# EAGLE design untitled (EAGLE 9.5.1)

## Sheet 1 of 2
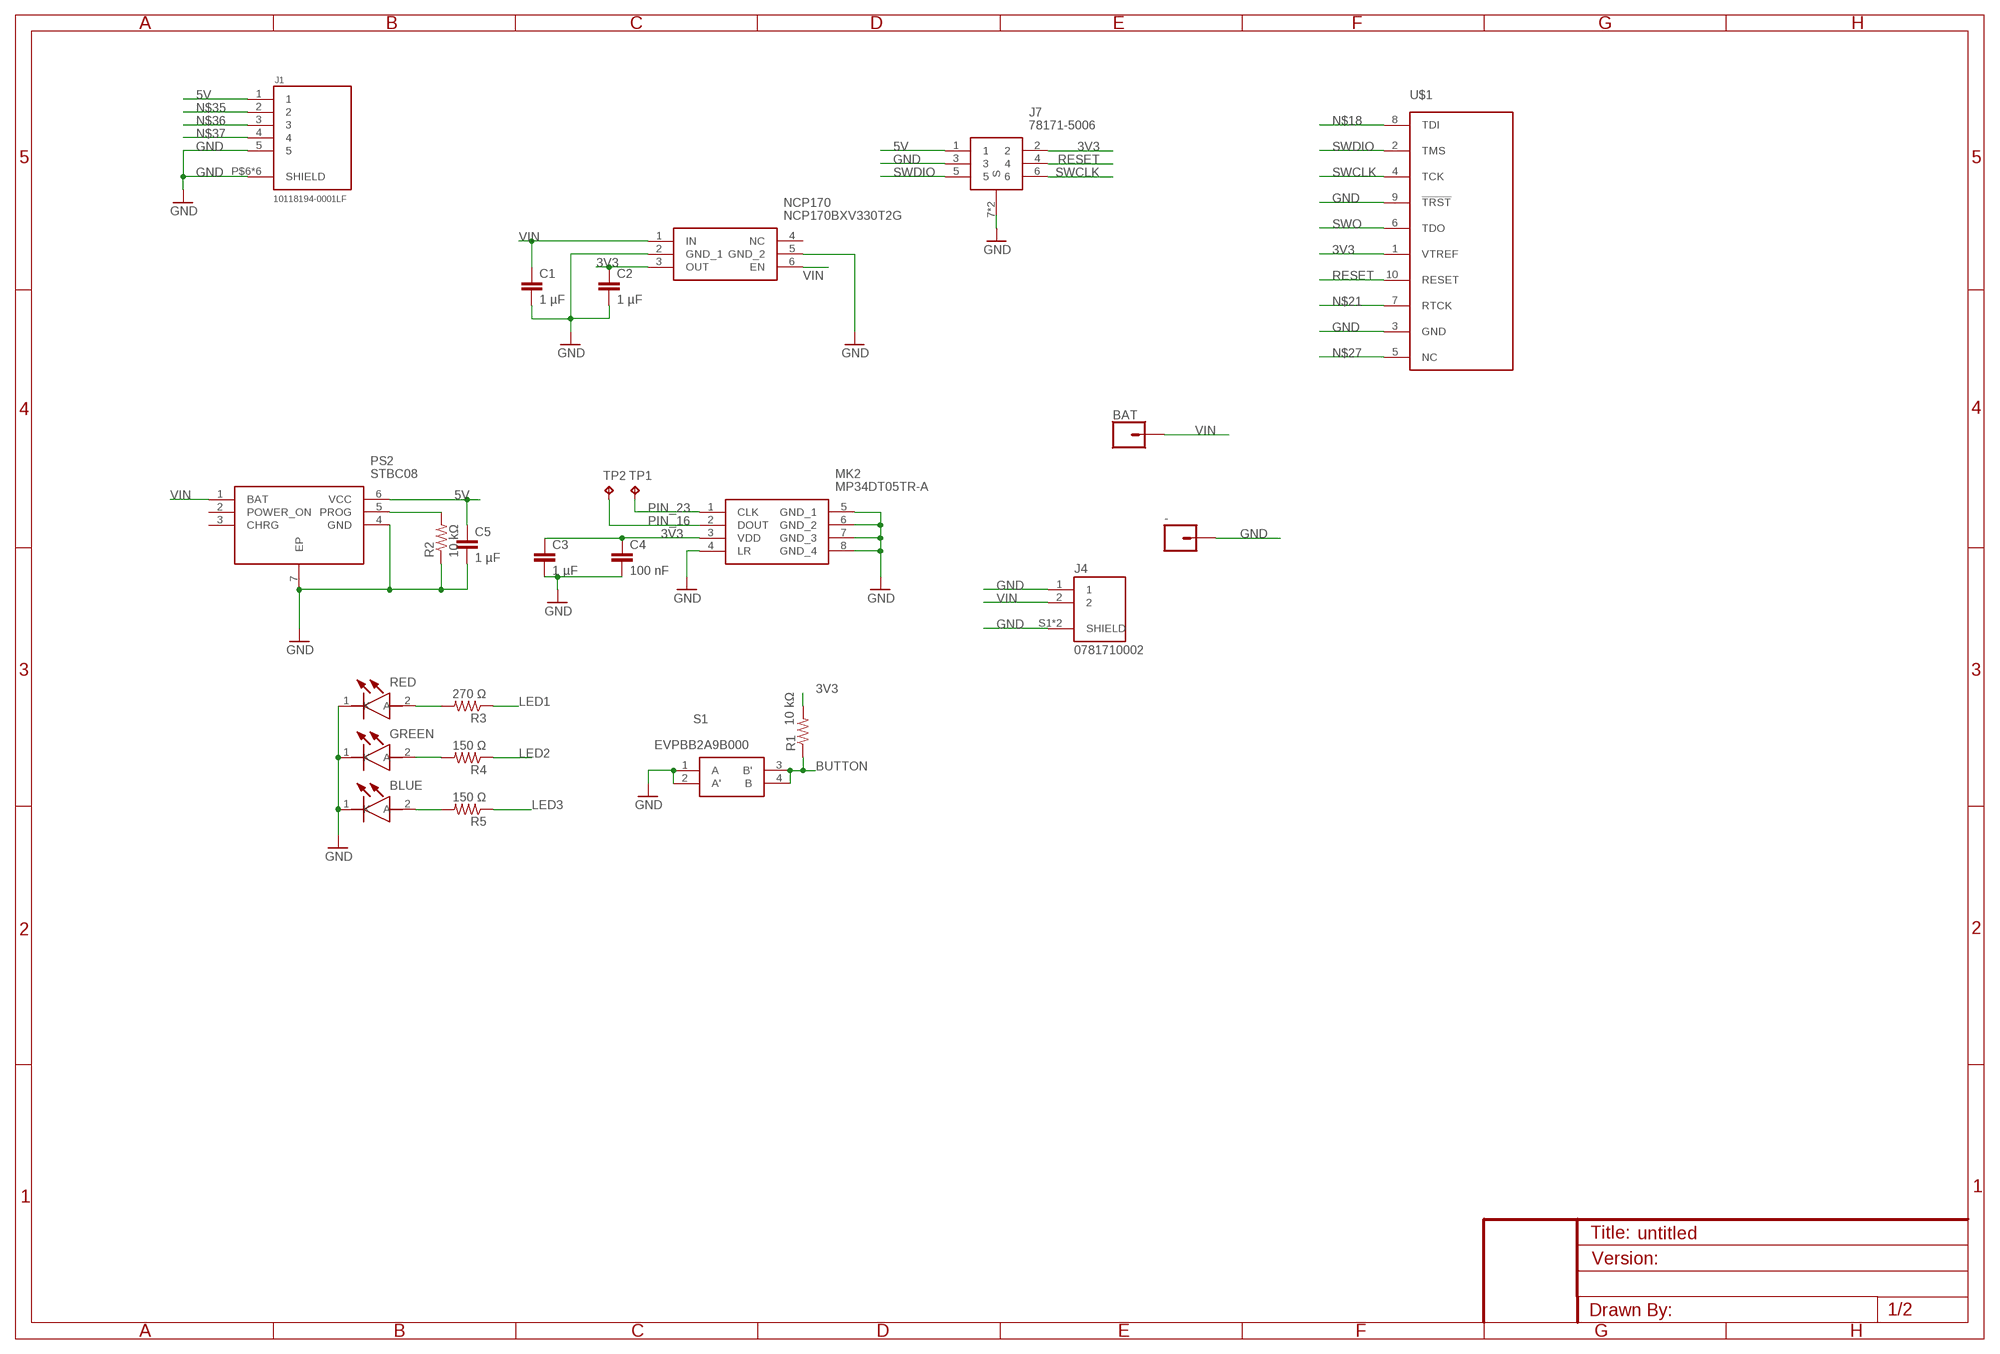
[diagram p0: schematic, sheet 1]

### Parts
-  CONN_01  [1X01]
BAT  CONN_01  [1X01]
BLUE  150040GS73220  [LEDC1005X50N]
C1  1 µF  SPARKFUN_CAP0402-CAP  [SPARKFUN_0402-CAP]
C2  1 µF  SPARKFUN_CAP0402-CAP  [SPARKFUN_0402-CAP]
C3  1 µF  SPARKFUN_CAP0402-CAP  [SPARKFUN_0402-CAP]
C4  100 nF  SPARKFUN_CAP0402-CAP  [SPARKFUN_0402-CAP]
C5  1 µF  SPARKFUN_CAP0402-CAP  [SPARKFUN_0402-CAP]
GREEN  150040GS73220  [LEDC1005X50N]
J1  10118194-0001LF  [AMPHENOL_10118194-0001LF]
J4  0781710002  [MOLEX_0781710002]
J7  78171-5006  [78171-5006]
MK2  MP34DT05TR-A  [MP34DT05TRA]
NCP170  NCP170BXV330T2G  [SOTFL50P160X60-6N]
PS2  STBC08  STBC08PMR  [SON95P300X300X100-7N]
R1  10 kΩ  SPARKFUN_RESISTOR0402-RES  [SPARKFUN_0402-RES]
R2  10 kΩ  SPARKFUN_RESISTOR0402-RES  [SPARKFUN_0402-RES]
R3  270 Ω  SPARKFUN_RESISTOR0402-RES  [SPARKFUN_0402-RES]
R4  150 Ω  SPARKFUN_RESISTOR0402-RES  [SPARKFUN_0402-RES]
R5  150 Ω  SPARKFUN_RESISTOR0402-RES  [SPARKFUN_0402-RES]
RED  150040GS73220  [LEDC1005X50N]
S1  EVPBB2A9B000  [EVPBB2A9B000]
TP1  TPTP06R  [TP06R]
TP2  TPTP06R  [TP06R]
U$1  TC2050-NL-MCP-NL  [TC2030-MCP-NL]

### Nets
3V3: C2.1 C3.1 C4.1 J7.2 MK2.3(VDD) NCP170.3(OUT) R1.2 U$1.1(VTREF) ; also sheet 2
5V: C5.1 J1.1 J7.1 PS2.6(VCC)
BUTTON: R1.1 S1.3(B') S1.4(B) ; also sheet 2
GND: -.1 BLUE.1(K) C1.2 C2.2 C3.2 C4.2 C5.2 GREEN.1(K) J1.5 J1.P$6(SHIELD) J1.P$7(SHIELD) J1.P$8(SHIELD) J1.P$9(SHIELD) J1.P$10(SHIELD) J1.P$11(SHIELD) J4.1 J4.S1(SHIELD) J4.S2(SHIELD) J7.3 J7.7(S) J7.8(S) MK2.4(LR) MK2.5(GND_1) MK2.6(GND_2) MK2.7(GND_3) MK2.8(GND_4) NCP170.2(GND_1) NCP170.5(GND_2) PS2.4(GND) PS2.7(EP) R2.1 RED.1(K) S1.1(A) S1.2(A') U$1.3(GND) U$1.9(!TRST) ; also sheet 2
LED1: R3.1 ; also sheet 2
LED2: R4.1 ; also sheet 2
LED3: R5.1 ; also sheet 2
N$2: R3.2 RED.2(A)
N$3: GREEN.2(A) R4.2
N$4: BLUE.2(A) R5.2
N$18: U$1.8(TDI)
N$21: U$1.7(RTCK)
N$23: PS2.5(PROG) R2.2
N$27: U$1.5(NC)
N$35: J1.2
N$36: J1.3
N$37: J1.4
PIN_16: MK2.2(DOUT) TP2.TP ; also sheet 2
PIN_23: MK2.1(CLK) TP1.TP ; also sheet 2
RESET: J7.4 U$1.10(RESET) ; also sheet 2
SWCLK: J7.6 U$1.4(TCK) ; also sheet 2
SWDIO: J7.5 U$1.2(TMS) ; also sheet 2
SWO: U$1.6(TDO) ; also sheet 2
VIN: BAT.1 C1.1 J4.2 NCP170.1(IN) NCP170.6(EN) PS2.1(BAT)
Unconnected: NCP170.4(NC) PS2.2(POWER_ON) PS2.3(CHRG)

## Sheet 2 of 2
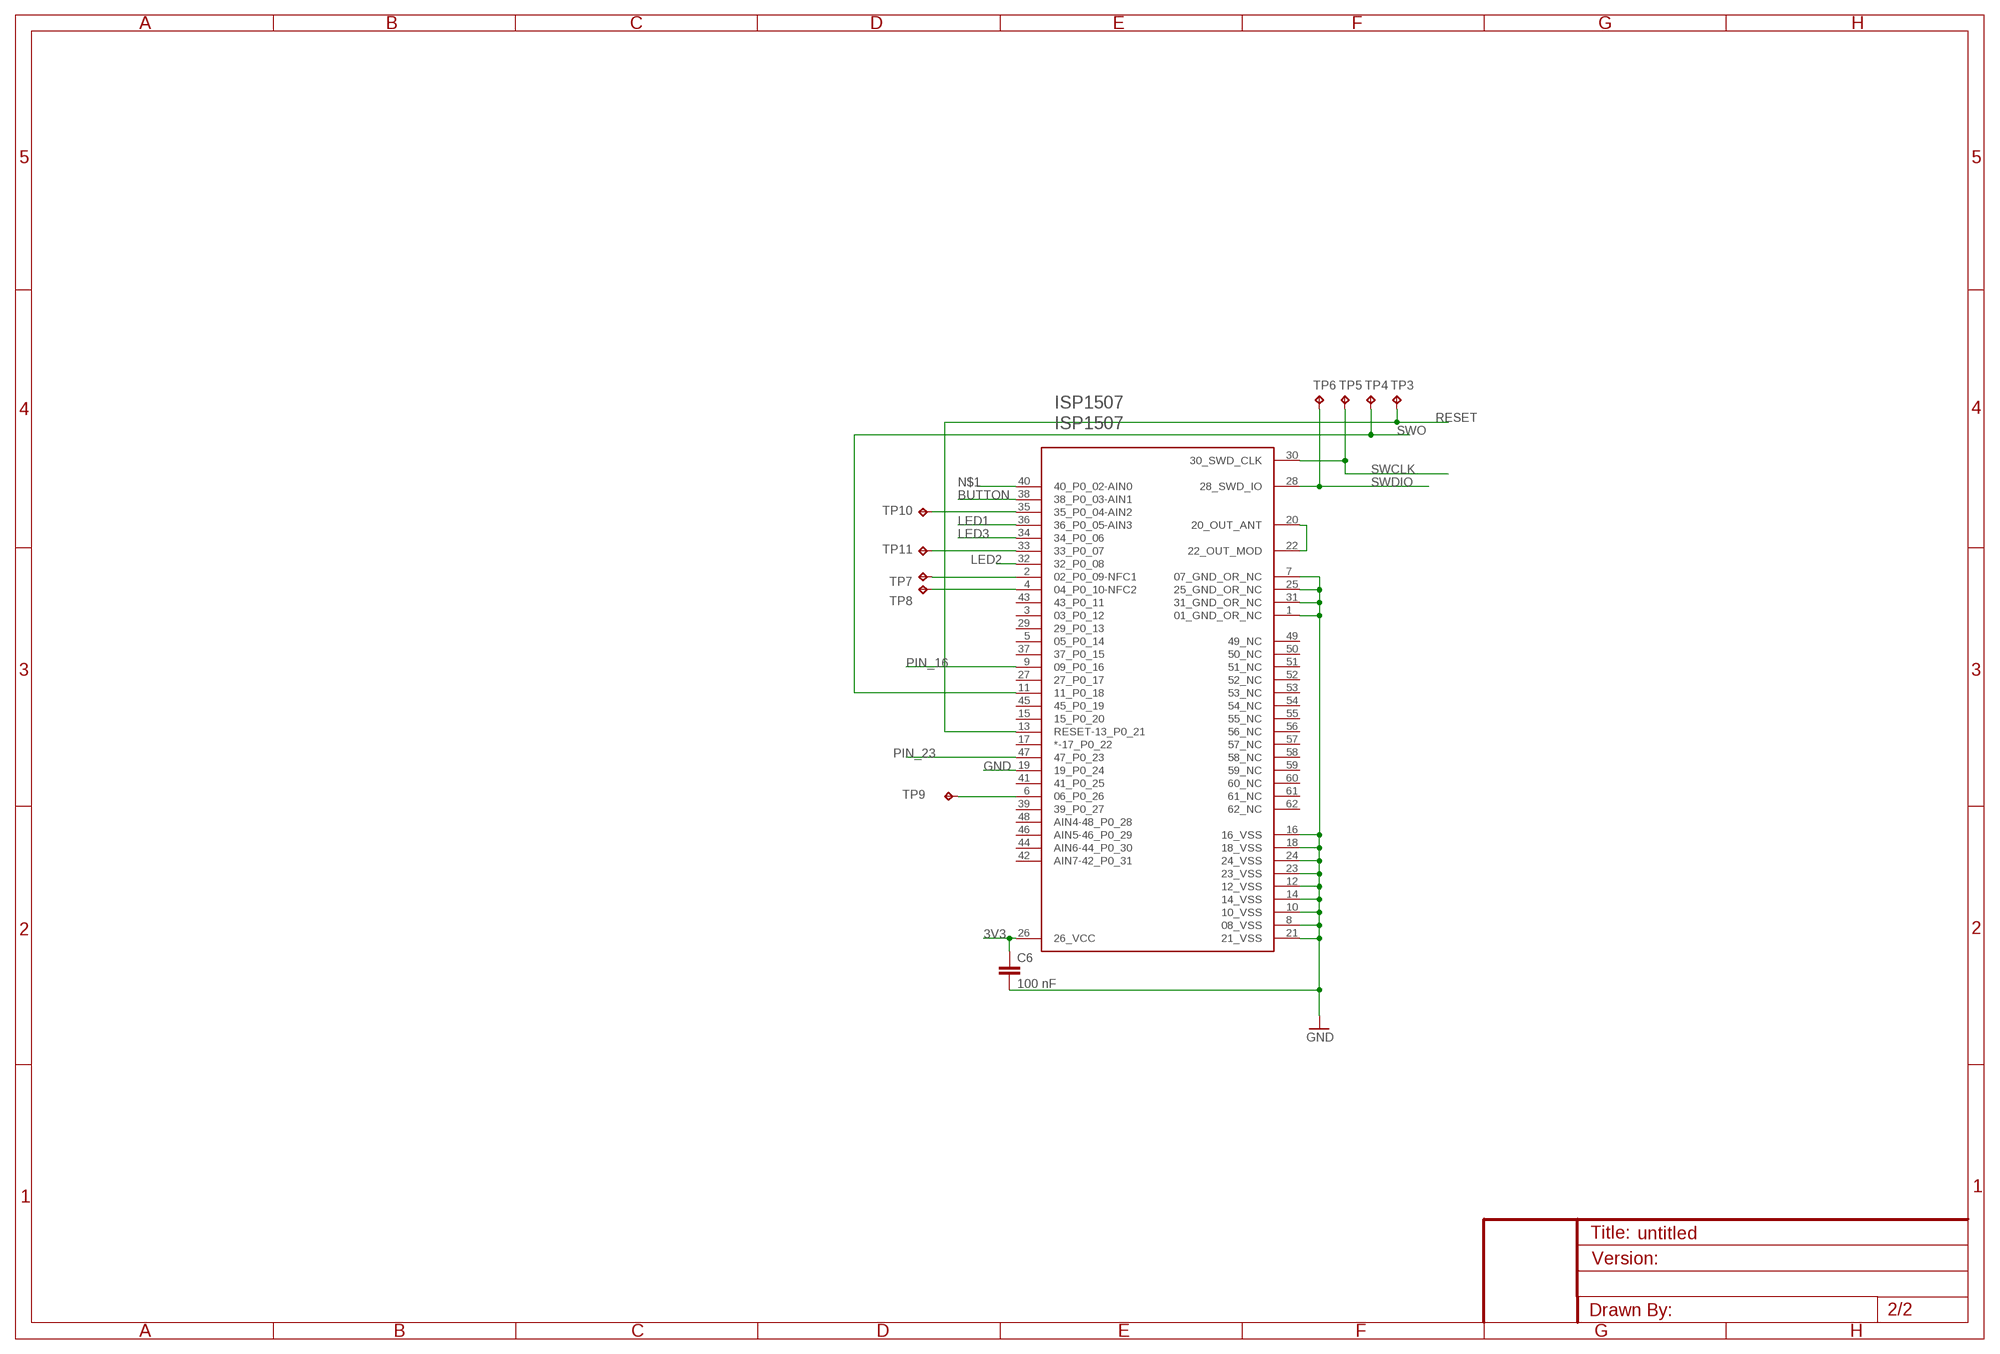
[diagram p1: schematic, sheet 2]

### Parts
C6  100 nF  SPARKFUN_CAP0402-CAP  [SPARKFUN_0402-CAP]
ISP1507  ISP1507  [ISP1507]
TP3  TPTP06R  [TP06R]
TP4  TPTP06R  [TP06R]
TP5  TPTP06R  [TP06R]
TP6  TPTP06R  [TP06R]
TP7  TPTP06R  [TP06R]
TP8  TPTP06R  [TP06R]
TP9  TPTP06R  [TP06R]
TP10  TPTP06R  [TP06R]
TP11  TPTP06R  [TP06R]

### Nets
3V3: C6.1 ISP1507.26(26_VCC) ; also sheet 1
BUTTON: ISP1507.38(38_P0_03-AIN1) ; also sheet 1
GND: C6.2 ISP1507.1(01_GND_OR_NC) ISP1507.7(07_GND_OR_NC) ISP1507.8(08_VSS) ISP1507.10(10_VSS) ISP1507.12(12_VSS) ISP1507.14(14_VSS) ISP1507.16(16_VSS) ISP1507.18(18_VSS) ISP1507.19(19_P0_24) ISP1507.21(21_VSS) ISP1507.23(23_VSS) ISP1507.24(24_VSS) ISP1507.25(25_GND_OR_NC) ISP1507.31(31_GND_OR_NC) ; also sheet 1
LED1: ISP1507.36(36_P0_05-AIN3) ; also sheet 1
LED2: ISP1507.32(32_P0_08) ; also sheet 1
LED3: ISP1507.34(34_P0_06) ; also sheet 1
N$1: ISP1507.40(40_P0_02-AIN0)
N$5: ISP1507.6(06_P0_26) TP9.TP
N$6: ISP1507.2(02_P0_09-NFC1) TP7.TP
N$7: ISP1507.4(04_P0_10-NFC2) TP8.TP
N$13: ISP1507.35(35_P0_04-AIN2) TP10.TP
N$14: ISP1507.33(33_P0_07) TP11.TP
N$24: ISP1507.20(20_OUT_ANT) ISP1507.22(22_OUT_MOD)
PIN_16: ISP1507.9(09_P0_16) ; also sheet 1
PIN_23: ISP1507.47(47_P0_23) ; also sheet 1
RESET: ISP1507.13(RESET-13_P0_21) TP3.TP ; also sheet 1
SWCLK: ISP1507.30(30_SWD_CLK) TP5.TP ; also sheet 1
SWDIO: ISP1507.28(28_SWD_IO) TP6.TP ; also sheet 1
SWO: ISP1507.11(11_P0_18) TP4.TP ; also sheet 1
Unconnected: ISP1507.3(03_P0_12) ISP1507.5(05_P0_14) ISP1507.15(15_P0_20) ISP1507.17(*-17_P0_22) ISP1507.27(27_P0_17) ISP1507.29(29_P0_13) ISP1507.37(37_P0_15) ISP1507.39(39_P0_27) ISP1507.41(41_P0_25) ISP1507.42(AIN7-42_P0_31) ISP1507.43(43_P0_11) ISP1507.44(AIN6-44_P0_30) ISP1507.45(45_P0_19) ISP1507.46(AIN5-46_P0_29) ISP1507.48(AIN4-48_P0_28) ISP1507.49(49_NC) ISP1507.50(50_NC) ISP1507.51(51_NC) ISP1507.52(52_NC) ISP1507.53(53_NC) ISP1507.54(54_NC) ISP1507.55(55_NC) ISP1507.56(56_NC) ISP1507.57(57_NC) ISP1507.58(58_NC) ISP1507.59(59_NC) ISP1507.60(60_NC) ISP1507.61(61_NC) ISP1507.62(62_NC)

## Library data of the parts
- BAT = SparkFun-Connectors:CONN_01: Single connection point. Often used as Generic Header-pin footprint for 0.1 inch spaced/style header connections On any of the 0.1 inch spaced packages, you can populate with these: Break Away Headers - Straight <https://www.sparkfun.com/products/116> (PRT-00116) Break Away Male Headers - Right Angle <https://www.sparkfun.com/products/553> (PRT-00553) Female Headers <https://www.sparkfun.com/products/115> (PRT-00115) Break Away Headers - Machine Pin <https://www.sparkfun.com/products/117> (PRT-00117) Break Away Female Headers - Swiss Machine Pin <https://www.sparkfun.com/products/743> (PRT-00743) This device is also useful as a general connection point to wire up your design to another part of your project. Our various solder wires solder well into these plated through hole pads. Hook-Up Wire - Assortment (Stranded, 22 AWG) <https://www.sparkfun.com/products/11375> (PRT-11375) Hook-Up Wire - Assortment (Solid Core, 22 AWG) <https://www.sparkfun.com/products/11367> (PRT-11367) View the entire wire category on our website here <https://www.sparkfun.com/categories/141> Special notes: SMTSO-256-ET is a "flush mount" nut for a 4-40 screw. We mostly use this on specialty testbeds; it is a nice way to connect hardware to your PCB at an adjustable hieght. Also note, the SNAP packages are for using a snappable style connector. We sell a baggie of snaps and they are also used on two LilyPad designs: Snap Assortment - 30 pack (male and female) <https://www.sparkfun.com/products/11347> (DEV-11347) LilyPad Arduino SimpleSnap <https://www.sparkfun.com/products/10941> (DEV-10941) LilyPad SimpleSnap Protoboard <https://www.sparkfun.com/products/10940> (DEV-10940)
BLUE GREEN RED = 150040GS73220:150040GS73220: WURTH ELEKTRONIK - 150040GS73220 - LED, Green, SMD, 0402, Rectangular, 3.3V/20mA Forward, 525nm, 750mcd, 120? Viewing Angle Source: Datasheet <https://www.farnell.com/cad/2723069.pdf>; DESCRIPTION: WURTH ELEKTRONIK - 150040GS73220 - LED, Green, SMD, 0402, Rectangular, 3.3V/20mA Forward, 525nm, 750mcd, 120? Viewing Angle; HEIGHT: 0.5mm; MANUFACTURER_NAME: Wurth Elektronik; MANUFACTURER_PART_NUMBER: 150040GS73220
C1-C6 = OCTA-EZR_v1:SPARKFUN_CAP: Capacitor Standard 0603 ceramic capacitor, and 0.1" leaded capacitor.
ISP1507 = ISP1507:ISP1507: ISP1507 BLE Module Based on the nRF52832 Bluetooth Low Energy Chip with Integrated Antenna, oscillators and Power Supply http://www.insightsip.com/products/bluetooth-smart-modules/isp1507
J1 = 10118194-0001LF:10118194-0001LF: Micro Usb, 2.0 Type b, Rcpt, Smt
J4 = 0781710002:0781710002: Conn Wire to Board HDR 2 POS 1.2mm Solder ST SMD; AVAILABILITY: Unavailable; DESCRIPTION: Conn Wire to Board HDR 2 POS 1.2mm Solder ST SMD Pico-EZmateâ¢ Embossed T/R; MF: Molex; MP: 0781710002; PACKAGE: None; PRICE: None
J7 = 78171-5006:78171-5006: Molex 78171 Series, 1.2mm Pitch 6 Way 1 Row Vertical PCB Header, Solder Termination, 1.5A Source: Datasheet <http://www.molex.com/molex/products/datasheet.jsp?part=active/0781715006_PCB_HEADERS.xml&channel=Products&Lang=en-US>; DESCRIPTION: Molex 78171 Series, 1.2mm Pitch 6 Way 1 Row Vertical PCB Header, Solder Termination, 1.5A; HEIGHT: mm; MANUFACTURER_NAME: Molex; MANUFACTURER_PART_NUMBER: 78171-5006; MOUSER_PART_NUMBER: 538-78171-5006; MOUSER_PRICE-STOCK: https://www.mouser.com/Search/Refine.aspx?Keyword=538-78171-5006; RS_PART_NUMBER: 8967484; RS_PRICE-STOCK: http://uk.rs-online.com/web/p/products/8967484
MK2 = MP34DT05TR-A:MP34DT05TR-A: STMICROELECTRONICS - MP34DT05TR-A - MEMS MICROPHONE, 3.6V, HCLGA-4 Source: Datasheet <http://www.st.com/content/ccc/resource/technical/document/datasheet/group3/c7/90/d3/f6/b7/e7/40/c8/DM00415595/files/DM00415595.pdf/jcr:content/translations/en.DM00415595.pdf>; DESCRIPTION: STMICROELECTRONICS - MP34DT05TR-A - MEMS MICROPHONE, 3.6V, HCLGA-4; HEIGHT: 1mm; MANUFACTURER_NAME: STMicroelectronics; MANUFACTURER_PART_NUMBER: MP34DT05TR-A; MOUSER_PART_NUMBER: 511-MP34DT05TR-A; MOUSER_PRICE-STOCK: https://www.mouser.com/Search/Refine.aspx?Keyword=511-MP34DT05TR-A
NCP170 = NCP170BXV330T2G:NCP170BXV330T2G: LDO Voltage Regulators ULTRA-LOW IQ 150 MA Source: Datasheet <http://www.onsemi.com/pub/Collateral/NCP170-D.PDF>; DESCRIPTION: LDO Voltage Regulators ULTRA-LOW IQ 150 MA; HEIGHT: 0.6mm; MANUFACTURER_NAME: ON Semiconductor; MANUFACTURER_PART_NUMBER: NCP170BXV330T2G; MOUSER_PART_NUMBER: 863-NCP170BXV330T2G; MOUSER_PRICE-STOCK: https://www.mouser.com/Search/Refine.aspx?Keyword=863-NCP170BXV330T2G
PS2 = STBC08PMR:STBC08PMR: STMicroelectronics STBC08PMR, Battery Charger, 800mA, 6-Pin DFN Source: Datasheet <https://componentsearchengine.com/Datasheets/2/STBC08PMR.pdf>; ARROW_PART_NUMBER: STBC08PMR; DESCRIPTION: STMicroelectronics STBC08PMR, Battery Charger, 800mA, 6-Pin DFN; HEIGHT: 1mm; MANUFACTURER_NAME: STMicroelectronics; MANUFACTURER_PART_NUMBER: STBC08PMR; RS_PART_NUMBER: 1655533
R1-R5 = OCTA-EZR_v1:SPARKFUN_RESISTOR: Resistor Basic schematic elements and footprints for 0603, 1206, and PTH resistors.
S1 = EVPBB2A9B000:EVPBB2A9B000: IP67 Push Plate Tact Switch, SPST 20 mA @ 15 V dc 0.7 (Dia.)mm Surface Mount Source: Datasheet <https://industrial.panasonic.com/ac/cdn/e/control/switch/light-touch/catalog/sw_lt_eng_2616s.pdf>; DESCRIPTION: IP67 Push Plate Tact Switch, SPST 20 mA @ 15 V dc 0.7 (Dia.)mm Surface Mount; HEIGHT: 0mm; MANUFACTURER_NAME: Panasonic; MANUFACTURER_PART_NUMBER: EVPBB2A9B000; RS_PART_NUMBER: 1250187P; RS_PRICE-STOCK: http://uk.rs-online.com/web/p/products/1250187P
TP1-TP11 = testpad:TP: Test pad
U$1 = TC2050:TC2050-NL: TAG-CONNECT ISP Connector Manufacturer: Tag-Connect <www.tag-connect.com> Cable for easy In-Circuit PCB Programming. Designed for JTAG 10 pin, suitable for many others. Pin Connection for TC2050 NL. PAD Description 1 VTREF 2 TMS 3 GND 4 TCK 5 NC 6 TDO 7 RTCK 8 TDI 9 !TRST 10 RESET ©2009 ROFA.cz Modified 7/2011 by Tim McCarthy-Smith VIDA Products INC

## Net classes
0 default: width 0.178 mm

## Board
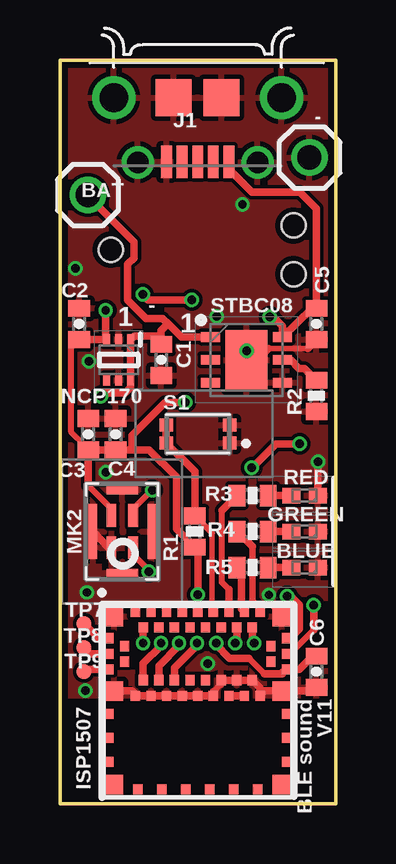
[diagram p2: board, top side]
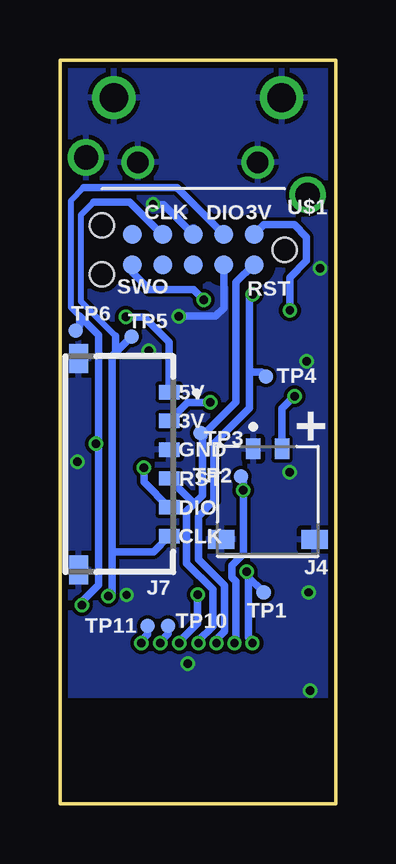
[diagram p3: board, bottom side, seen from below]

Size 11.5 x 31 mm. Coordinates in mm from the lower left corner, seen from the top.
Outline: 0,0 11.5,0 11.5,31 0,31 0,0
Copper layers (1*16): Top 0.018mm / dielectric 1.55mm / Bottom 0.018mm
Design rules "eC_2Layer_PClass6_BaseCopperO18_eCDefault *": minimum track width 0.1mm, minimum drill 0.35mm, track to track 0.15mm, track to pad 0.15mm, pad to pad 0.15mm, via to via 0.15mm, smd to smd 0mil, copper to edge 0.25mm, drill to drill 0.35mm, minimum pad ring 0.175mm, minimum via ring 0.125mm, stop-mask expansion 0mil, vias tented up to drill 0.45mm, thermal gap 0.2mm

### Footprints (pad centres in the part's own frame; a part is rotated, then mirrored left to right if it is on the bottom)
1X01 = drill 1.016 pad 1.524: 1 0,0
LEDC1005X50N = smd 0.75 x 0.65: 1 -0.55,0; 2 0.55,0
SPARKFUN_0402-CAP = smd 0.7 x 0.9: 1 -0.65,0; 2 0.65,0
ISP1507 = smd 0.8 x 0.8: 1 0.5,7.5; 7 0.5,4.4; 25 7.5,4.4; 31 7.5,7.5; 52 0.5,0.5; 59 7.5,0.5 | smd 0.4 x 0.4: 2 0.3,6.6; 3 0.95,6.275; 4 0.3,5.95; 5 0.95,5.625; 6 0.3,5.3; 8 1.4,4.2; 9 1.725,4.85; 10 2.05,4.2; 11 2.375,4.85; 12 2.7,4.2; 13 3.025,4.85; 14 3.35,4.2; 15 3.675,4.85; 16 4,4.2; 17 4.325,4.85; 18 4.65,4.2; 19 4.975,4.85; 20 5.3,4.2; 21 5.625,4.85; 22 5.95,4.2; 23 6.275,4.85; 24 6.6,4.2; 26 7.7,5.3; 27 7.05,5.625; 28 7.7,5.95; 29 7.05,6.275; 30 7.7,6.6; 32 6.6,7.7; 33 6.275,7.05; 34 5.95,7.7; 35 5.625,7.05; 36 5.3,7.7; 37 4.975,7.05; 38 4.65,7.7; 39 4.325,7.05; 40 4,7.7; 41 3.675,7.05; 42 3.35,7.7; 43 3.025,7.05; 44 2.7,7.7; 45 2.375,7.05; 46 2.05,7.7; 47 1.725,7.05; 48 1.4,7.7; 49 0.3,3.45; 50 0.3,2.45; 51 0.3,1.45; 53 1.5,0.3; 54 2.5,0.3; 55 3.5,0.3; 56 4.5,0.3; 57 5.5,0.3; 58 6.5,0.3; 60 7.7,1.45; 61 7.7,2.45; 62 7.7,3.45
AMPHENOL_10118194-0001LF = smd 0.45 x 1.35: 1 -3.84,2.675; 2 -3.19,2.675; 3 -2.54,2.675; 4 -1.89,2.675; 5 -1.24,2.675 | drill 0.9: P$6 -5.04,2.7; P$7 -0.04,2.7 | drill 1.2: P$8 -6.04,0; P$9 0.96,0 | smd 1.5 x 1.55: P$10 -3.54,0; P$11 -1.54,0
MOLEX_0781710002 = smd 0.6 x 0.85: 1 -0.6,3.775; 2 0.6,3.775 | smd 1.106 x 0.8: S1 -1.928,0; S2 1.953,0
78171-5006 = smd 0.6 x 0.85: 1 -3,4.34; 2 -1.8,4.34; 3 -0.6,4.34; 4 0.6,4.34; 5 1.8,4.34; 6 3,4.34 | smd 1.208 x 0.8: 7 -4.404,0.565; 8 4.404,0.565
MP34DT05TRA = smd 0.4 x 0.95: 1 -0.45,0.675; 2 -0.45,-0.675; 3 0.45,-0.675; 4 0.45,0.675 | smd 0.35 x 2.3: 5 -1.225,0; 6 1.225,0 | smd 1.3 x 0.35: 7 0,1.725; 8 0,-1.725
SOTFL50P160X60-6N = smd 0.475 x 0.3: 1 -0.838,0.5; 2 -0.838,0; 3 -0.838,-0.5; 4 0.838,-0.5; 5 0.838,0; 6 0.838,0.5
SON95P300X300X100-7N = smd 0.8 x 0.4: 1 -1.5,0.95; 2 -1.5,0; 3 -1.5,-0.95; 4 1.5,-0.95; 5 1.5,0; 6 1.5,0.95 | smd 1.75 x 2.5: 7 0,0
SPARKFUN_0402-RES = smd 0.7 x 0.9: 1 -0.65,0; 2 0.65,0
EVPBB2A9B000 = smd 0.55 x 0.55: 1 -1.336,0.364; 2 -1.336,-0.386; 3 1.314,-0.386; 4 1.314,0.364
TP06R = smd 0.6 x 0.6: TP 0,0
TC2030-MCP-NL = smd 0.787 x 0.787: 1 1.27,-0.635; 2 2.54,-0.635; 3 3.81,-0.635; 4 5.08,-0.635; 5 6.35,-0.635; 6 6.35,0.635; 7 5.08,0.635; 8 3.81,0.635; 9 2.54,0.635; 10 1.27,0.635 | hole 1: 0,0; 7.62,-1.016; 7.62,1.016

### Placement (x,y rotation side)
-  10.41,26.93 0 top
BAT  1.17,25.37 0 top
BLUE  10.2,9.84 180 top
C1  4.23,18.5 270 top
C2  0.8,20 90 top
C3  1.18,15.4 90 top
C4  2.32,15.4 90 top
C5  10.7,20 270 top
C6  10.7,5.5 270 top
GREEN  10.2,11.34 180 top
ISP1507  1.75,0.29 0 top
J1  3.21,29.43 180 top
J4  2.84,11.01 0 bottom
J7  11.28,14.15 270 bottom
MK2  2.6,11.34 180 top
NCP170  2.45,18.5 270 top
PS2  7.78,18.5 0 top
R1  5.63,11.34 270 top
R2  10.7,17 90 top
R3  8.04,12.84 0 top
R4  8.04,11.34 0 top
R5  8.04,9.84 0 top
RED  10.2,12.84 180 top
S1  5.75,15.4 180 top
TP1  3,8.8 0 bottom
TP2  3.94,13.64 0 bottom
TP3  5.64,15.45 0 bottom
TP4  2.9,17.81 0 bottom
TP5  8.51,19.48 0 bottom
TP6  10.85,19.73 0 bottom
TP7  1,7.5 0 top
TP8  1,6.5 0 top
TP9  1,5.5 0 top
TP10  7,7.4 0 bottom
TP11  7.84,7.4 0 bottom
U$1  2.12,23.09 180 bottom

### Tracks (layer width: path | path; a pad name or v marks a point on that pad's centre or on a via)
3V3  (via drill 0.35)
  Top 0.229: 8.54,5.41 7.88,6.06
  Top 0.254: 2.16,12.29 1.18,13.27 | 1.09,14.88 0.45,15.52 0.45,18.98 C2.1
  Top 0.305: C6.1 10.55,6.16 9.98,5.59 ISP1507.26 9.27,5.48 9.27,5.41 8.54,5.41 | v6.52,6.69 6.52,6.62 7.08,6.06 7.88,6.06 | MK2.3 2.16,12.03 2.16,12.29 | 1.18,13.27 C3.1 | C3.1 1.09,14.88 | C2.1 0.81,19.34 NCP170.3 1.91,19.38 v1.91,20.56 | v5.75,8.7 5.75,10.56 R1.2 4.87,11.45 4.87,13.61 3.73,14.75 3,14.75 | C3.1 C4.1 3,14.75 | 3,14.75 3,15.35 4.38,16.72 v5.22,16.72
  Bottom 0.305: v6.52,6.69 6.52,6.75 5.75,7.51 v5.75,8.7 | U$1.1 2.99,24.13 1.72,24.13 1.21,23.62 1.21,22.63 1.91,21.94 v1.91,20.56 | v5.22,16.72 6.17,16.72 J7.2
5V  (via drill 0.35)
  Top 0.305: J1.1 7.05,26.45 8,25.5 10,25.5 10.7,24.8 C5.1 10.52,20.64 PS2.6 9.28,19.91 8.9,20.29 v8.74,20.29
  Bottom 0.305: J7.1 6.94,19.25 7.98,20.29 v8.74,20.29
BUTTON
  Top 0.229: 6.34,11.27 6.34,8.05
  Top 0.254: R1.1 6.34,11.27
  Top 0.305: S1.3 S1.4 5.63,13.85 R1.1 | 6.34,8.05 ISP1507.38
GND  (via drill 0.35)
  Top 0.229: 8.7,18.97 10.34,18.97
  Top 0.279: 6.73,4.98 6.4,4.66
  Top 0.305: 3.21,4.49 ISP1507.10 ISP1507.12 ISP1507.14 ISP1507.16 ISP1507.18 6.4,4.66 | 3.21,4.49 ISP1507.8 | 3.21,4.49 3.01,4.69 ISP1507.7 | v10.77,14.25 10.77,12.71 RED.1 | MK2.4 2.03,10.67 MK2.6 | PS2.7 8.23,18.5 8.7,18.97 | 10.34,18.97 C5.2 | v8.72,8.7 8.72,8.45 9.25,7.92 ISP1507.31 | C6.2 10.54,4.69 ISP1507.25 8.55,4.69 ISP1507.24 8.35,4.82 ISP1507.23 ISP1507.21 ISP1507.19 6.73,4.98
  Bottom 0.305: U$1.9 4.66,20.66 5.01,20.31 v6.55,20.31 | U$1.3 7.18,24.97 v7.62,24.97
  other vias: 1.12,8.8 1.92,13.81 7.8,18.87 6.17,5.84 1.06,4.7 0.65,22.32 1.22,18.43
  pour Top: 0.04,4.51 11.59,4.51 11.59,31.03 0.04,31.03
  pour Bottom: 0.04,4.52 11.59,4.52 11.59,31.03 0.04,31.03
LED1
  Top 0.254: 6.76,9.22 6.76,12.21
  Top 0.279: 7.05,8.93 6.76,9.22
  Top 0.305: ISP1507.36 7.05,8.93 | 6.76,12.21 R3.1
LED2
  Top 0.279: 8.35,8.16 8.04,8.47 8.04,10.71
  Top 0.305: ISP1507.32 8.35,8.16 | 8.04,10.71 7.41,11.34 R4.1
LED3
  Top 0.305: R5.1 7.58,9.65 7.58,8.12 ISP1507.34
N$2
  Top 0.305: R3.2 RED.2
N$3
  Top 0.305: GREEN.2 R4.2
N$4
  Top 0.305: BLUE.2 R5.2
N$5
  Top 0.305: ISP1507.6 1.09,5.59 TP9.TP
N$6
  Top 0.305: ISP1507.2 1.61,6.89 TP7.TP
N$7
  Top 0.305: ISP1507.4 1.26,6.24 TP8.TP
N$13  (via drill 0.35)
  Top 0.305: ISP1507.35 7.38,6.75 v7.31,6.69
  Bottom 0.305: v7.31,6.69 7.31,6.75 7,7.06 TP10.TP
N$14  (via drill 0.35)
  Top 0.305: ISP1507.33 8.02,6.78 v8.11,6.69
  Bottom 0.305: TP11.TP 7.84,7.06 8.11,6.78 v8.11,6.69
N$23
  Top 0.305: R2.2 10.21,18.14 9.97,18.14 9.64,18.5 PS2.5
N$24
  Top 0.305: ISP1507.20 ISP1507.22
PIN_16  (via drill 0.35)
  Top 0.254: 3.84,13.07 3.03,12.26
  Top 0.305: MK2.2 3.03,12.26 | 3.84,13.07 v3.85,13.07 | ISP1507.9 3.48,5.84 4.22,6.58 v4.22,6.69
  Bottom 0.305: v4.22,6.69 4.16,6.75 4.16,9.26 4.33,9.43 4.33,9.92 3.85,10.4 v3.85,13.07 3.85,13.64 TP2.TP
PIN_23  (via drill 0.35)
  Top 0.254: 3.71,9.73 3.05,10.39
  Top 0.305: v3.71,9.67 3.71,9.73 | 3.05,10.39 MK2.1 | v3.47,6.69 3.47,7.33 ISP1507.47
  Bottom 0.305: v3.47,6.69 3.65,6.93 3.65,9.6 v3.71,9.67 3.71,9.51 TP1.TP
RESET  (via drill 0.35)
  Top 0.305: v5.72,6.69 5.72,6.59 4.77,5.65 ISP1507.13
  Bottom 0.305: v5.72,6.69 5.72,6.8 5.12,7.39 5.12,8.93 6.21,10.02 6.21,12.19 5.9,12.5 | U$1.10 3.43,22.45 4.15,21.73 4.15,16.74 5.5,15.4 5.5,15.31 5.56,15.37 | 5.9,12.5 5.9,12.51 J7.4 | 5.9,12.5 5.56,12.84 5.56,15.37 | TP3.TP 5.56,15.37
SWCLK  (via drill 0.35)
  Top 0.305: v9.48,8.65 9.62,8.65 9.98,8.29 9.98,7.28 9.59,6.89 ISP1507.30
  Bottom 0.254: 9.18,19.49 10.63,20.94 10.63,24.53 10.09,25.08
  Bottom 0.305: v9.48,8.65 9.46,8.65 9.32,8.79 9.32,10.5 | U$1.4 7.23,23.72 8.59,25.08 10.09,25.08 | 9.32,10.5 9.32,18.66 9.18,18.8 | 9.18,18.8 9.18,19.49 | TP5.TP 9.18,18.8 | J7.6 7.59,10.5 9.32,10.5
SWDIO  (via drill 0.35)
  Top 0.254: 10.59,7.24 9.58,6.23
  Top 0.305: ISP1507.28 9.47,6.23 9.58,6.23 | v10.59,8.27 v10.59,8.26 10.59,7.24 | v10,15 9,15 v8,14
  Bottom 0.254: 10.5,25.67 11.04,25.12 11.04,20.69 10.67,20.33
  Bottom 0.305: v10.59,8.27 10.59,8.41 9.88,9.11 9.88,15 | 9.88,15 9.88,19.54 10.67,20.33 10.67,19.9 TP6.TP | U$1.2 6.61,25.67 10.5,25.67 | 9.88,15 v10,15 | J7.5 8,13.41 v8,14
SWO  (via drill 0.35)
  Top 0.305: v4.97,6.69 4.97,6.59 4.12,5.75 ISP1507.11 | v5.5,21 3.68,21 v3.45,21.23
  Bottom 0.305: v4.97,6.69 4.97,6.85 4.64,7.18 4.64,9.09 5.72,10.18 5.72,11.97 5.07,12.63 5.07,15.01 3.59,16.49 3.59,18 | 3.59,18 3.59,21.09 v3.45,21.23 | U$1.6 8.47,22.13 7.76,21.42 5.92,21.42 v5.5,21 | TP4.TP 3.09,18 3.59,18
VIN  (via drill 0.35)
  Top 0.305: v1.72,16.98 1.85,17.12 2.73,17.12 2.95,17.34 NCP170.6 NCP170.1 3.11,19.5 4.23,19.5 | PS2.1 5.07,19.45 4.51,20.01 | 4.51,20.01 4.29,20.23 3.59,20.23 2.83,20.99 2.83,22.49 3.09,22.75 3.09,23.41 1.17,25.33 BAT.1 | C1.1 4.23,19.5 | 4.23,19.5 4.23,19.73 4.51,20.01
  Bottom 0.305: J4.2 2.24,16.46 v1.72,16.98

### Text on the board
tNames: 1 | - | 1 | BLE sound / V11
bNames: 3V | DIO | CLK | RST | SWO | 5V | 3V | + | GND | RST | DIO | CLK